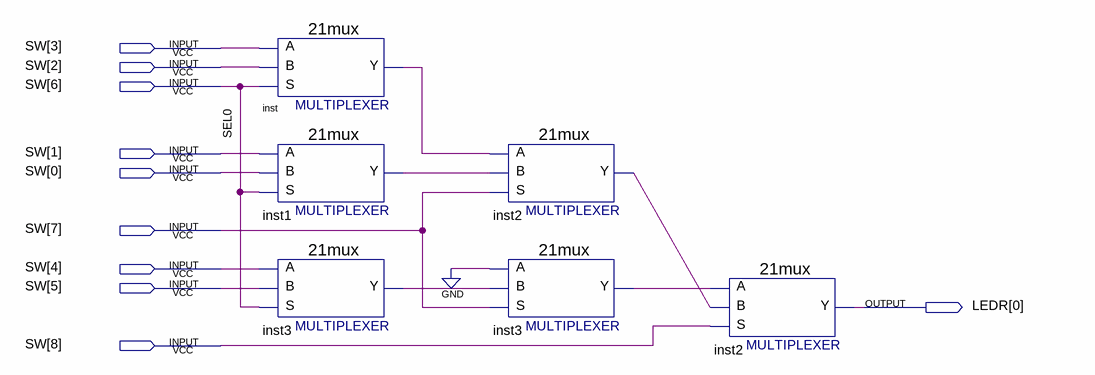
[diagram p0: schematic sheet]
// Quartus schematic mux_6_a_1.bdf as structural Verilog: 6 symbols, 10 pins
module mux_6_a_1 (
  input  [8:0] SW,
  output [0:0] LEDR
);

  wire inst1_y, inst2_y, inst3_y, inst3_y_2, inst_y;

  \21mux  inst (.S(SW[6]), .B(SW[2]), .A(SW[3]), .Y(inst_y));
  \21mux  inst1 (.S(SW[6]), .B(SW[0]), .A(SW[1]), .Y(inst1_y));
  \21mux  inst3 (.S(SW[6]), .B(SW[5]), .A(SW[4]), .Y(inst3_y));
  \21mux  inst2 (.S(SW[7]), .B(inst1_y), .A(inst_y), .Y(inst2_y));
  \21mux  inst3_dup2 (.S(SW[7]), .B(inst3_y), .A(1'b0), .Y(inst3_y_2));
  \21mux  inst2_dup2 (.S(SW[8]), .B(inst2_y), .A(inst3_y_2), .Y(LEDR[0]));

  // Other names for the same wires on the sheet: SEL0 = SW[6]
endmodule
